# EAGLE schematic SIM808 (EAGLE 9.6.0)
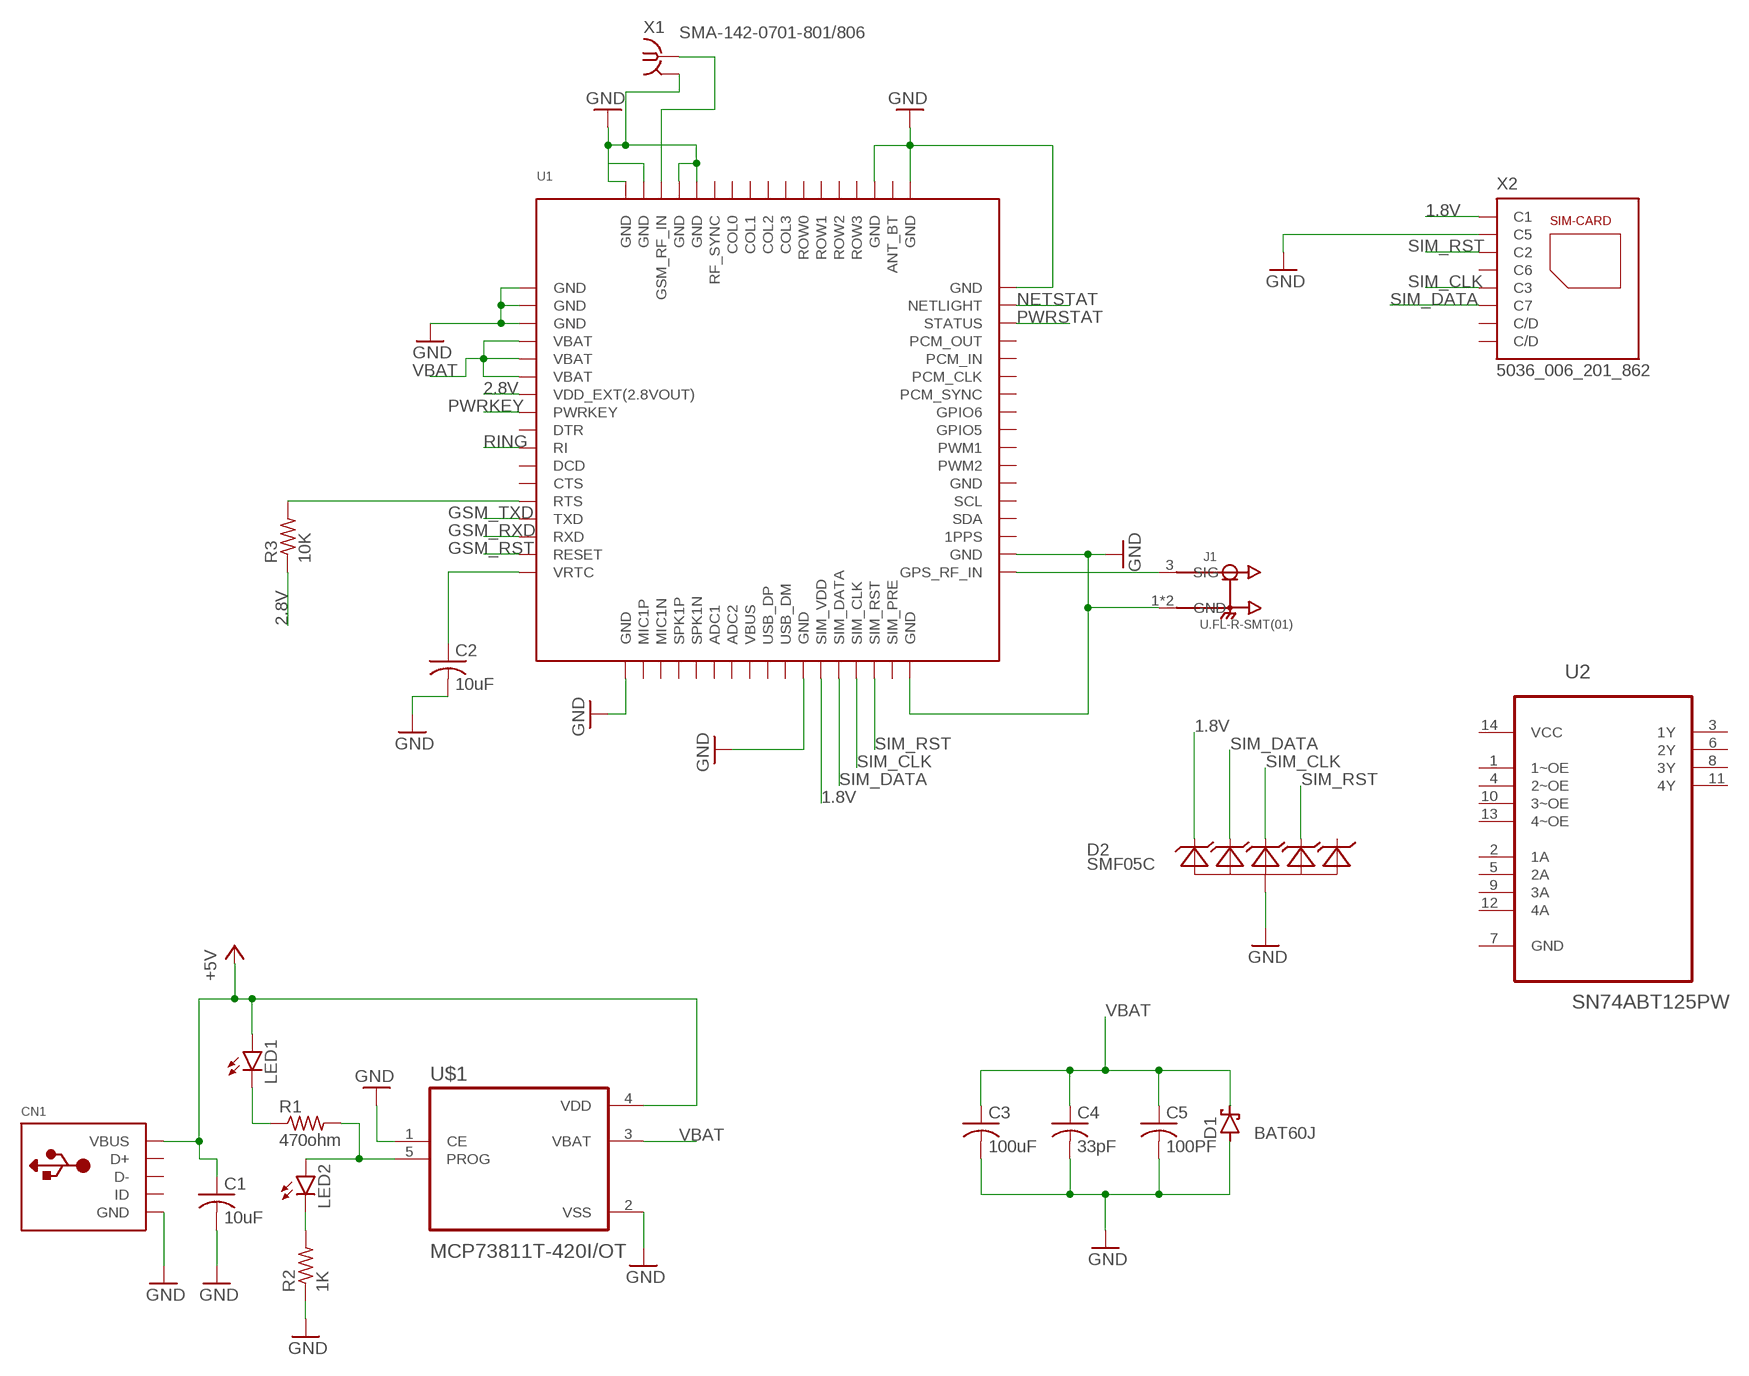
[diagram p0: schematic, sheet 1]

## Parts
C1  10uF  C-USC0805  [C0805]
C2  10uF  C-USC0805  [C0805]
C3  100uF  C-USC0805  [C0805]
C4  33pF  C-USC0805  [C0805]
C5  100PF  C-USC0805  [C0805]
CN1  USBMINIB  [USB-MINIB]
D1  BAT60J  [SOD323_ST]
D2  SMF05C  [SC70-6]
J1  U.FL-R-SMT(01)  [HRS_U.FL-R-SMT(01)]
LED1  LEDSML0805  [SML0805]
LED2  LEDSML0805  [SML0805]
R1  470ohm  R-US_R0805  [R0805]
R2  1K  R-US_R0805  [R0805]
R3  10K  R-US_R0805  [R0805]
U1  GSM_SIM808_LITERAL  [SIM900_SMT]
U2  SN74ABT125PW  [SOP65P640X120-14N]
U$1  MCP73811T-420I/OT  [SOT95P280X145-5N]
X1  SMA-142-0701-801/806  [J502-ND-142-0701-801/806]
X2  5036_006_201_862  [5036_006_201_862]

## Nets
1.8V: D2.1(C1) U1.P$29(SIM_VDD) X2.C1
2.8V: R3.1 U1.P$7(VDD_EXT(2.8VOUT))
+5V: C1.1 CN1.VBUS LED1.A U$1.4(VDD)
GND: C1.2 C2.2 C3.2 C4.2 C5.2 CN1.GND D1.A D2.2(A) J1.1(GND) J1.2(GND) R2.1 U1.P$1(GND) U1.P$2(GND) U1.P$3(GND) U1.P$18(GND) U1.P$28(GND) U1.P$34(GND) U1.P$36(GND) U1.P$51(GND) U1.P$52(GND) U1.P$54(GND) U1.P$64(GND) U1.P$65(GND) U1.P$67(GND) U1.P$68(GND) U$1.1(CE) U$1.2(VSS) X1.G@1 X1.G@2 X1.G@3 X1.G@4 X2.C5
GSM_RST: U1.P$16(RESET)
GSM_RXD: U1.P$15(RXD)
GSM_TXD: U1.P$14(TXD)
N$1: LED2.A R1.2 U$1.5(PROG)
N$2: LED2.C R2.2
N$3: LED1.C R1.1
N$4: C2.1 U1.P$17(VRTC)
N$5: U1.P$66(GSM_RF_IN) X1.1
N$6: J1.3(SIG) U1.P$35(GPS_RF_IN)
N$8: R3.2 U1.P$13(RTS)
NETSTAT: U1.P$50(NETLIGHT)
PWRKEY: U1.P$8(PWRKEY)
PWRSTAT: U1.P$49(STATUS)
RING: U1.P$10(RI)
SIM_CLK: D2.4(C3) U1.P$31(SIM_CLK) X2.C3
SIM_DATA: D2.3(C2) U1.P$30(SIM_DATA) X2.C7
SIM_RST: D2.5(C4) U1.P$32(SIM_RST) X2.C2
VBAT: C3.1 C4.1 C5.1 D1.C U1.P$4(VBAT) U1.P$5(VBAT) U1.P$6(VBAT) U$1.3(VBAT)
Unconnected: CN1.D+ CN1.D- CN1.ID D2.6(C5) U1.P$9(DTR) U1.P$11(DCD) U1.P$12(CTS) U1.P$19(MIC1P) U1.P$20(MIC1N) U1.P$21(SPK1P) U1.P$22(SPK1N) U1.P$23(ADC1) U1.P$24(ADC2) U1.P$26(USB_DP) U1.P$27(USB_DM) U1.P$33(SIM_PRE) U1.P$37(1PPS) U1.P$38(SDA) U1.P$39(SCL) U1.P$41(PWM2) U1.P$42(PWM1) U1.P$43(GPIO5) U1.P$44(GPIO6) U1.P$45(PCM_SYNC) U1.P$46(PCM_CLK) U1.P$47(PCM_IN) U1.P$48(PCM_OUT) U1.P$53(ANT_BT) U1.P$55(ROW3) U1.P$56(ROW2) U1.P$57(ROW1) U1.P$58(ROW0) U1.P$59(COL3) U1.P$60(COL2) U1.P$61(COL1) U1.P$62(COL0) U1.P$63(RF_SYNC) U2.1(1~OE) U2.2(1A) U2.3(1Y) U2.4(2~OE) U2.5(2A) U2.6(2Y) U2.7(GND) U2.8(3Y) U2.9(3A) U2.10(3~OE) U2.11(4Y) U2.12(4A) U2.13(4~OE) X2.C6 X2.C/D@1(C/D) X2.C/D@2(C/D)

## Power pins joined to a net without a drawn wire
GND: U1.P$40(GND)
VBUS: U1.P$25(VBUS)
VCC: U2.14(VCC)

## Library data of the parts
C1-C5 = rcl:C-US: CAPACITOR, American symbol; SPICEPREFIX: C
CN1 = adafruit:USB: USB Connectors USBMINIB - Surface Mount Female Mini-B USB Connector 4UConnector: 06564 By microbuilder.eu Thru-hole RA Female Mini-B USB Connector 4UConnector: 18732 By ladyada.net
D1 = diode:BAT60J: Schottky barrier diode Source: www.st.com, BAT60J.pdf
D2 = SMF05C:SMF05C; AVAILABILITY: Unavailable; DESCRIPTION: 12.5V Clamp 8A _8/20µs_ Ipp Tvs Diode Surface Mount SC-88/SC70-6/SOT-363; MF: ProTek Devices; MP: SMF05C; PACKAGE: TSSOP-6 ProTek Devices; PRICE: None
J1 = U.FL-R-SMT_01_:U.FL-R-SMT(01): U.FL Series 6 Ghz 50 Ohm Ultra-small SMT Coaxial Cable Receptacle; AVAILABILITY: Unavailable; DESCRIPTION: U.FL _UMCC_ Connector Receptacle, Male Pin 50Ohm Surface Mount Solder; MF: Hirose; MP: U.FL-R-SMT_01_; PACKAGE: None; PRICE: None
LED1 LED2 = led:LED: LED OSRAM: - CHIPLED LG R971, LG N971, LY N971, LG Q971, LY Q971, LO R971, LY R971 LH N974, LH R974 LS Q976, LO Q976, LY Q976 LO Q996 - Hyper CHIPLED LW Q18S LB Q993, LB Q99A, LB R99A - SideLED LS A670, LO A670, LY A670, LG A670, LP A670 LB A673, LV A673, LT A673, LW A673 LH A674 LY A675 LS A676, LA A676, LO A676, LY A676, LW A676 LS A679, LY A679, LG A679 - Hyper Micro SIDELED® LS Y876, LA Y876, LO Y876, LY Y876 LT Y87S - SmartLED LW L88C, LW L88S LB L89C, LB L89S, LG L890 LS L89K, LO L89K, LY L89K LS L896, LA L896, LO L896, LY L896 - TOPLED LS T670, LO T670, LY T670, LG T670, LP T670 LSG T670, LSP T670, LSY T670, LOP T670, LYG T670 LG T671, LOG T671, LSG T671 LB T673, LV T673, LT T673, LW T673 LH T674 LS T676, LA T676, LO T676, LY T676, LB T676, LH T676, LSB T676, LW T676 LB T67C, LV T67C, LT T67C, LS T67K, LO T67K, LY T67K, LW E67C LS E67B, LA E67B, LO E67B, LY E67B, LB E67C, LV E67C, LT E67C LW T67C LS T679, LY T679, LG T679 LS T770, LO T770, LY T770, LG T770, LP T770 LB T773, LV T773, LT T773, LW T773 LH T774 LS E675, LA E675, LY E675, LS T675 LS T776, LA T776, LO T776, LY T776, LB T776 LHGB T686 LT T68C, LB T68C - Hyper Mini TOPLED® LB M676 - Mini TOPLED Santana® LG M470 LS M47K, LO M47K, LY M47K Source: http://www.osram.convergy.de LUXEON: - LUMILED® LXK2-PW12-R00, LXK2-PW12-S00, LXK2-PW14-U00, LXK2-PW14-V00 LXK2-PM12-R00, LXK2-PM12-S00, LXK2-PM14-U00 LXK2-PE12-Q00, LXK2-PE12-R00, LXK2-PE12-S00, LXK2-PE14-T00, LXK2-PE14-U00 LXK2-PB12-K00, LXK2-PB12-L00, LXK2-PB12-M00, LXK2-PB14-N00, LXK2-PB14-P00, LXK2-PB14-Q00 LXK2-PR12-L00, LXK2-PR12-M00, LXK2-PR14-Q00, LXK2-PR14-R00 LXK2-PD12-Q00, LXK2-PD12-R00, LXK2-PD12-S00 LXK2-PH12-R00, LXK2-PH12-S00 LXK2-PL12-P00, LXK2-PL12-Q00, LXK2-PL12-R00 Source: www.luxeon.com KINGBRIGHT: KA-3528ASYC Source: www.kingbright.com
R1-R3 = rcl:R-US_: RESISTOR, American symbol; SPICEPREFIX: R
U1 = adafruit:GSM_SIM808_LITERAL: SIM808 GSM Module
U2 = SN74ABT125PW:SN74ABT125PW: QUADRUPLE BUS BUFFER GATES WITH 3-STATE OUTPUTS; AVAILABILITY: Unavailable; DESCRIPTION: Buffer, Non-Inverting 4 Element 1 Bit per Element 3-State Output 14-TSSOP; MF: Texas Instruments; MP: SN74ABT125PW; PACKAGE: TSSOP-14 Texas Instruments; PRICE: None
U$1 = MCP73811T-420I_OT:MCP73811T-420I/OT; AVAILABILITY: Unavailable; DESCRIPTION: Charger IC Lithium Ion/Polymer SOT-23-5; MF: Microchip; MP: MCP73811T-420I/OT; PACKAGE: SOT-23 Microchip; PRICE: None
X1 = con-coax:SMA-: SMA 50 Ohm End Launch Jack Receptacle - Round Contact Johnson Components Source: www.johnsoncomponents.com .. J502-ND.pdf; MF: JOHNSON COMPONENTS; MPN: 142-0701-801; OC_FARNELL: 1608592; OC_NEWARK: 90F2624
X2 = con-kyocera-elco:5036_006_2?_862: SIM Card Module Source: http://www.kyocera-elco.com/prdct/pdf/5036.pdf; OC_FARNELL: unknown; OC_NEWARK: unknown